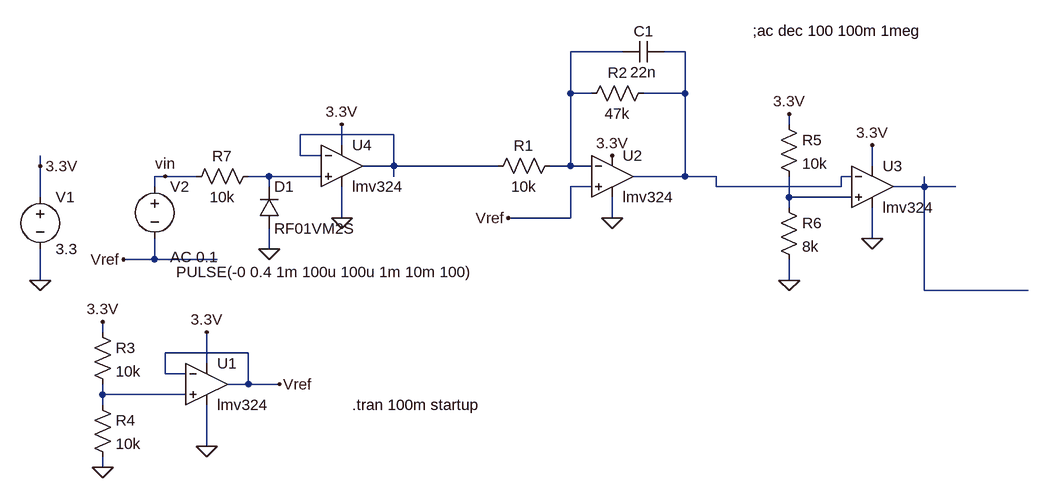
[diagram p0: schematic Piezo_amplifierV2.0.asc]
* Piezo_amplifierV2.0.asc
V1 3.3V 0 3.3
R3 3.3V N007 10k
R4 N007 0 10k
R5 3.3V N006 10k
R6 N006 0 8k
R1 N001 N003 10k
R2 N002 N001 47k
V2 vin Vref PULSE(-0 0.4 1m 100u 100u 1m 10m 100) AC 0.1
* U1: lmv324 (symbol lmv324 not available, pins judged from their places): In+=N007 In-=Vref V+=3.3V V-=0 OUT=Vref
* U2: lmv324 (symbol lmv324 not available, pins judged from their places): In+=Vref In-=N001 V+=3.3V V-=0 OUT=N002
* U3: lmv324 (symbol lmv324 not available, pins judged from their places): In+=N006 In-=N002 V+=3.3V V-=0 OUT=N005
C1 N002 N001 22n
* U4: lmv324 (symbol lmv324 not available, pins judged from their places): In+=N004 In-=N003 V+=3.3V V-=0 OUT=N003
D1 0 N004 RF01VM2S
R7 N004 vin 10k
.model D D
.lib standard.dio
.tran 100m startup
;ac dec 100 100m 1meg
.backanno
.end

* Results of the author's LTspice run, read from the files saved beside the schematic
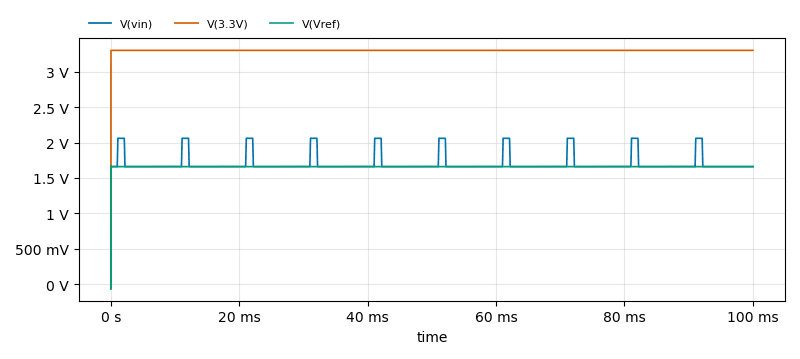
[diagram p1: Transient Analysis of Piezo_amplifierV2.0.asc, plotted from the saved traces]
* Transient Analysis, 1 run:
*   V(vin): min -63 mV, max 2.06 V, average 1.704 V, rms 1.708 V, last 1.66 V
*   V(3.3V): min 0 V, max 3.3 V, average 3.3 V, rms 3.3 V, last 3.3 V
*   V(Vref): min -63 mV, max 1.669 V, average 1.66 V, rms 1.66 V, last 1.66 V